# EAGLE design j310 lna (EAGLE 9.1.2)
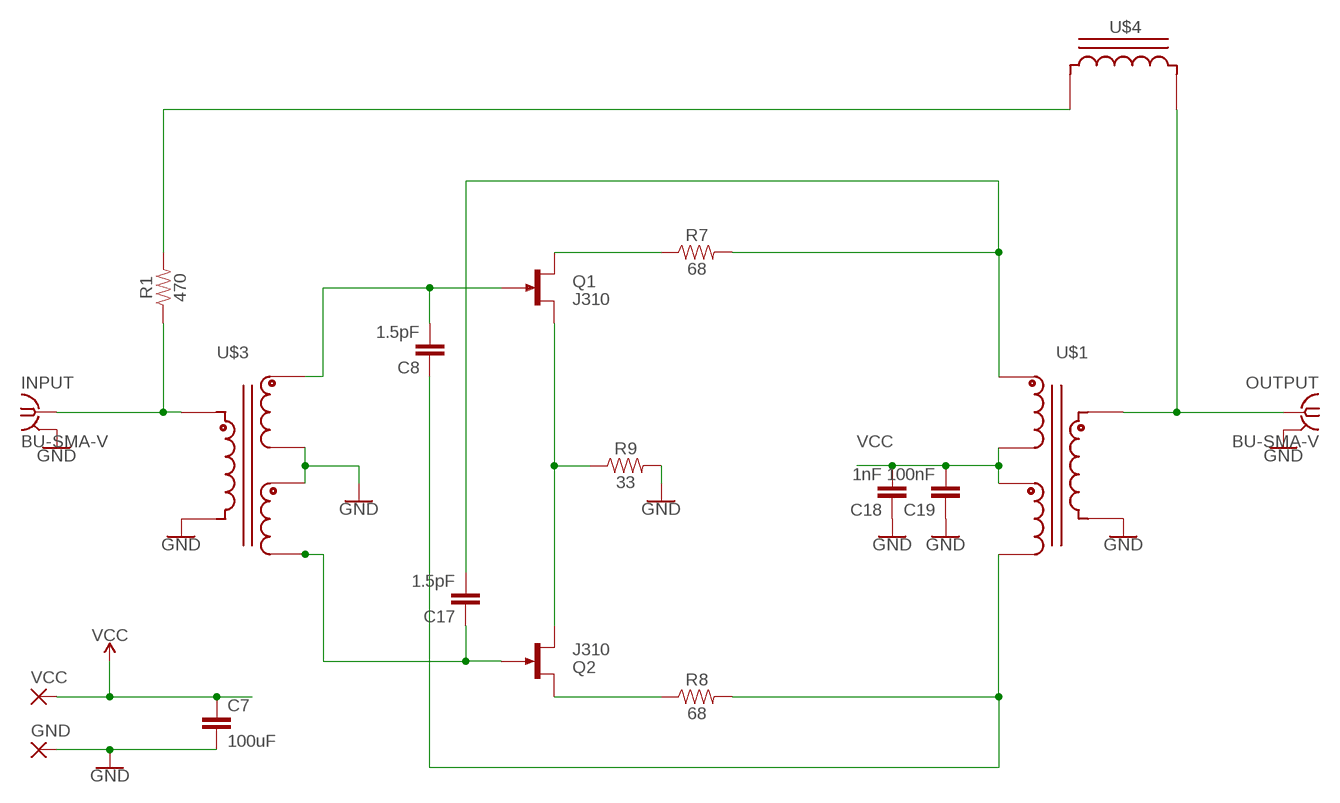
[diagram p0: schematic, sheet 1]

## Parts
C7  100uF  C5/3.5  [C5B3.5]
C8  1.5pF  C5/3.5  [C5B3.5]
C17  1.5pF  C5/3.5  [C5B3.5]
C18  1nF  C5/3.5  [C5B3.5]
C19  100nF  C5/3.5  [C5B3.5]
GND  3,17/1,1  [3,17/1,1]
INPUT  BU-SMA-V  [BU-SMA-V]
OUTPUT  BU-SMA-V  [BU-SMA-V]
Q1  J310  [TO92R]
Q2  J310  [TO92R]
R1  470  1KOHM-HORIZ-1/4W-1%  [AXIAL-0.3]
R7  68  1KOHM-HORIZ-1/4W-1%  [AXIAL-0.3]
R8  68  1KOHM-HORIZ-1/4W-1%  [AXIAL-0.3]
R9  33  1KOHM-HORIZ-1/4W-1%  [AXIAL-0.3]
U$1  T50_SPLITTER  [T50_SPLITTER]
U$3  T50_SPLITTER  [T50_SPLITTER]
U$4  T37_INDUCTOR  [T37_INDUCTOR]
VCC  3,17/1,1  [3,17/1,1]

## Nets
GND: C7.2 C18.1 C19.1 GND.1(P) INPUT.2 INPUT.3 INPUT.4 INPUT.5 OUTPUT.2 OUTPUT.3 OUTPUT.4 OUTPUT.5 R9.P$2 U$1.C1A U$3.C1A U$3.C2A(C3B) U$3.C3A(C2A)
N$1: OUTPUT.1 U$1.C1B U$4.CA
N$2: R1.P$2 U$4.CB
N$3: Q2.D R8.P$1
N$19: C8.2 Q1.G U$3.C3B(C2B)
N$20: Q1.D R7.P$1
N$21: C17.1 Q2.G U$3.C2B(C3A)
N$22: INPUT.1 R1.P$1 U$3.C1B
N$24: Q1.S Q2.S R9.P$1
N$25: C17.2 R7.P$2 U$1.C3B(C2B)
N$26: C8.1 R8.P$2 U$1.C2B(C3A)
VCC: C7.1 C18.2 C19.2 U$1.C2A(C3B) U$1.C3A(C2A) VCC.1(P)

## Library data of the parts
C7 C8 C17-C19 = capacitor-wima:C: CAPACITOR naming: grid - package width
GND VCC = wirepad:3,17/1,1: THROUGH-HOLE PAD
INPUT OUTPUT = con-coax:BU-SMA-V: FEMALE SMA CONNECTOR Radiall distributor RS 112-3794; OC_FARNELL: unknown; OC_NEWARK: unknown
Q1 Q2 = transistor-small-signal:J310: N-Channel RF Amplifier J309, J310 Source: http://www.fairchildsemi.com/pf/J3/J310.html
R1 R7-R9 = SparkFun-Resistors:1KOHM: 1kΩ resistor A resistor is a passive two-terminal electrical component that implements electrical resistance as a circuit element. Resistors act to reduce current flow, and, at the same time, act to lower voltage levels within circuits. - Wikipedia; PROD_ID: RES-12182; VALUE: 1k
U$1 U$3 = toroid:T50_SPLITTER: Transformer (having 3 windings) on a T50 Toroid
U$4 = toroid:T37_INDUCTOR: Inductor wound on a T37 Toroid

## Net classes
0 default: width 0.762 mm, drill 0.762 mm, clearance 0.508 mm

## Board
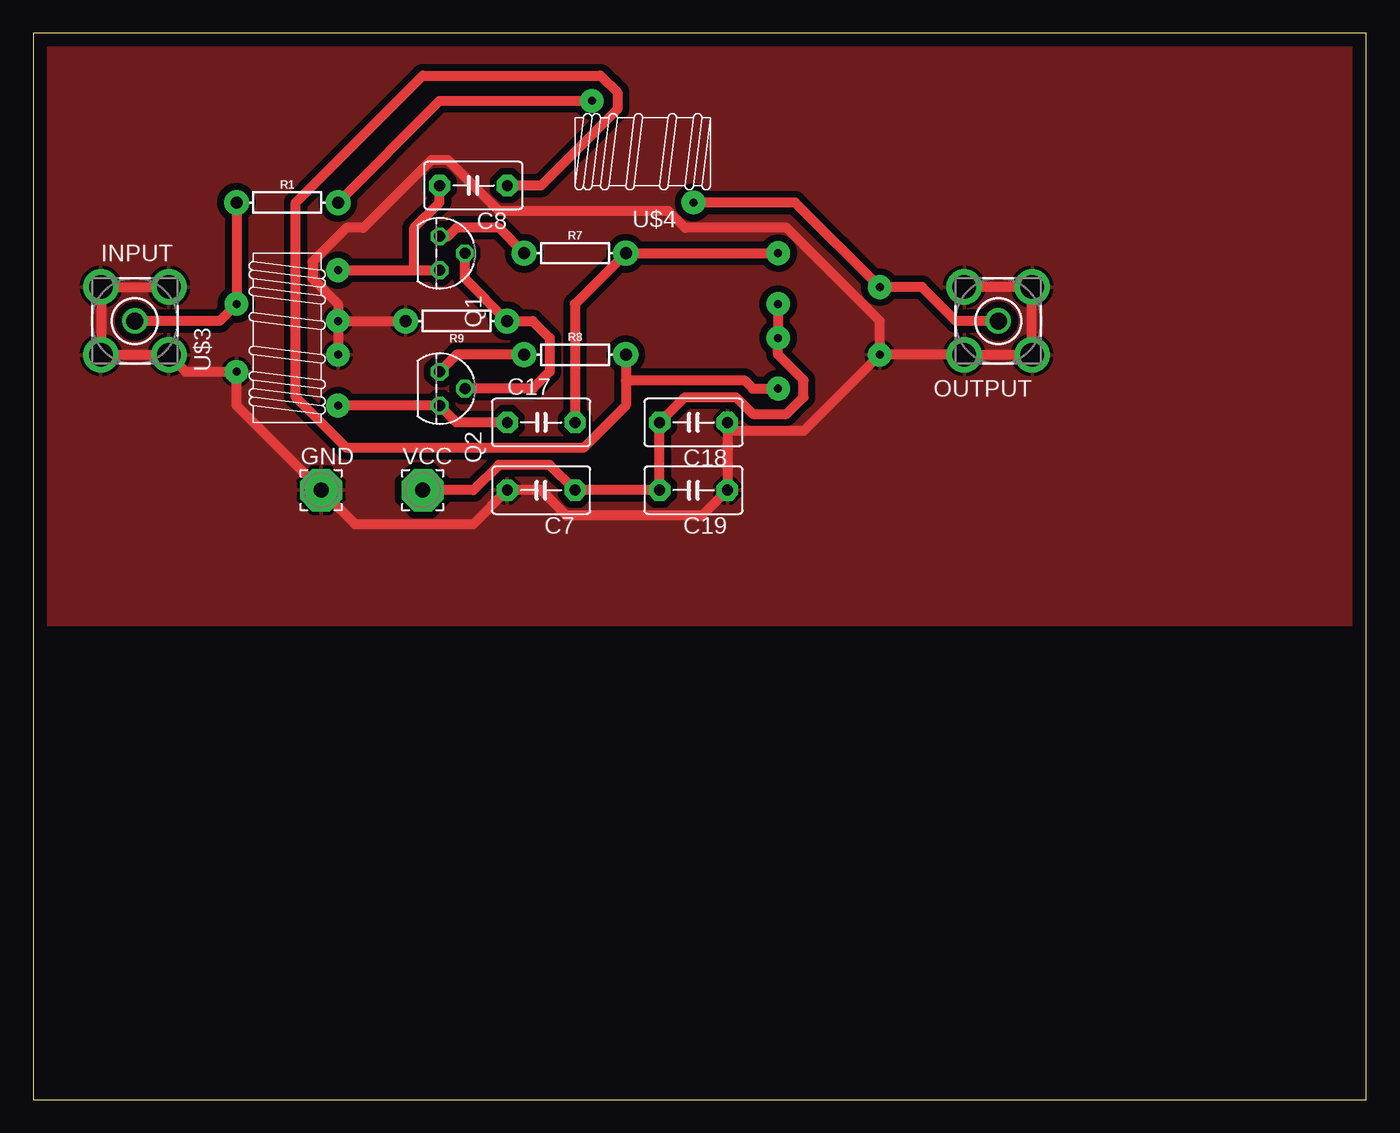
[diagram p1: board, top side]
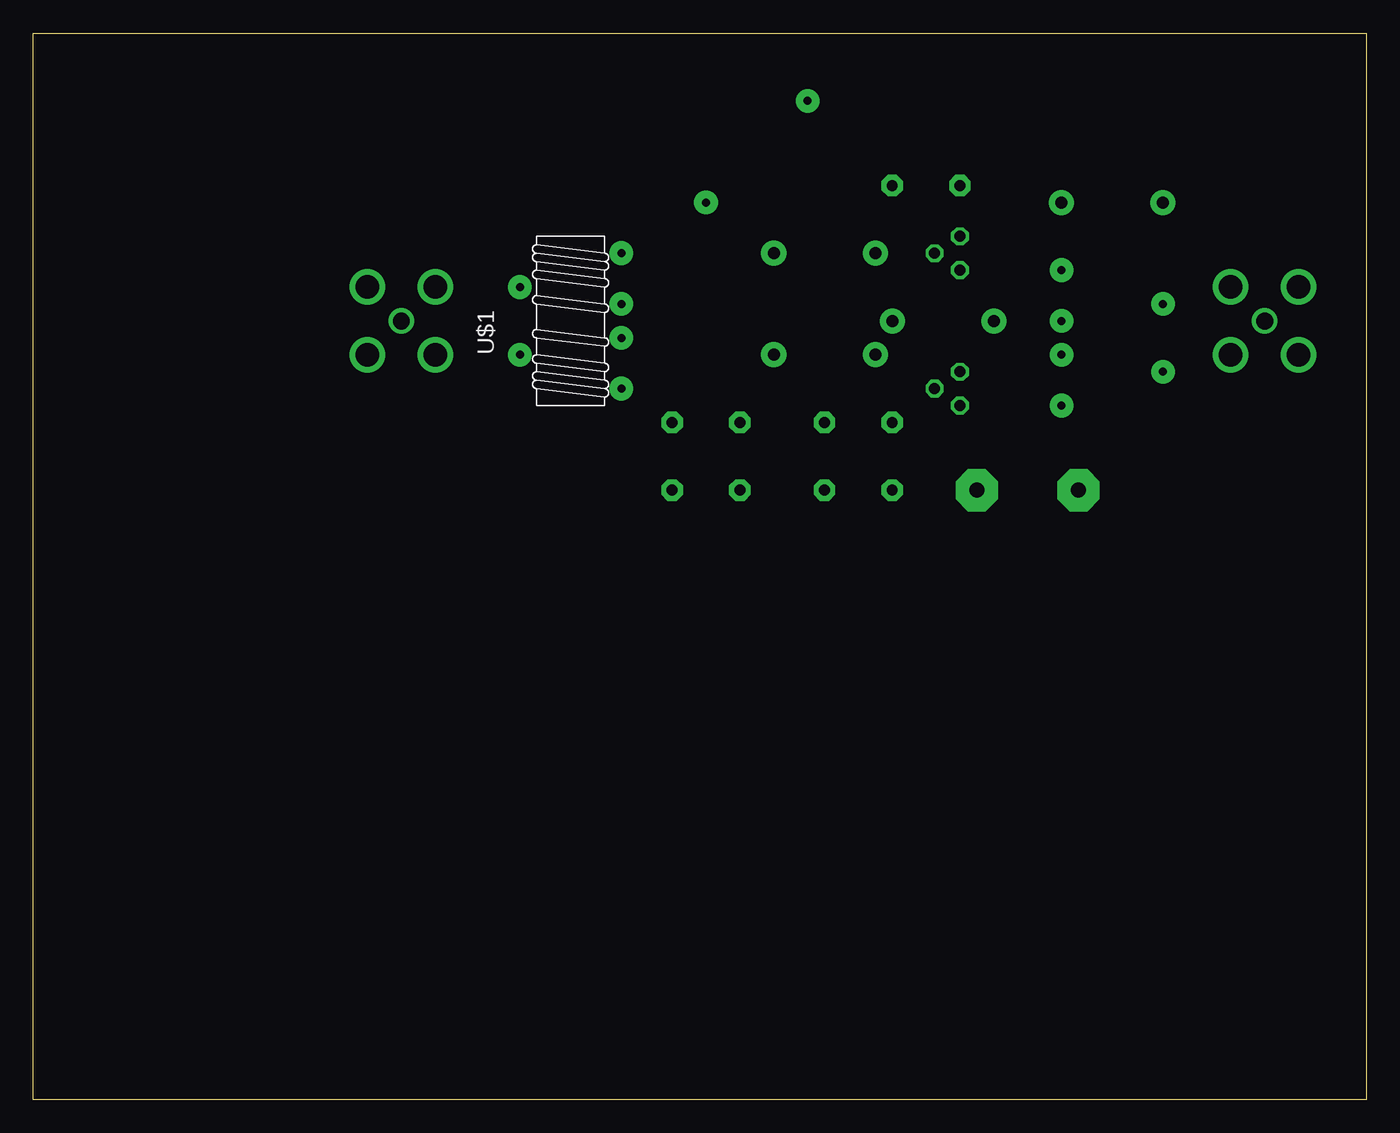
[diagram p2: board, bottom side, seen from below]

Size 100 x 80 mm. Coordinates in mm from the lower left corner, seen from the top.
Outline: 0,0 100,0 100,80 0,80 0,0
Copper layers (1*16): Top 0.035mm / dielectric 1.5mm / Bottom 0.035mm
Design rules "default": minimum track width 6mil, minimum drill 0.35mm, track to track 6mil, track to pad 6mil, pad to pad 6mil, via to via 6mil, smd to smd 6mil, copper to edge 40mil, drill to drill 6mil, minimum pad ring 10mil, minimum via ring 8mil, stop-mask expansion 4mil, vias tented up to drill 0mil, thermal gap 10mil

### Footprints (pad centres in the part's own frame; a part is rotated, then mirrored left to right if it is on the bottom)
C5B3.5 = drill 0.813 pad 1.6 octagon: 1 -2.54,0; 2 2.54,0
3,17/1,1 = drill 1.118 pad 3.175 octagon: 1 0,0
BU-SMA-V = drill 1.27: 1 0,0 | drill 1.778: 2 -2.55,2.55; 3 2.55,2.55; 4 2.55,-2.55; 5 -2.55,-2.55
TO92R = drill 0.813 octagon: D -1.27,0; G 1.27,0; S 0,1.905
AXIAL-0.3 = drill 0.9 pad 1.88: P$1 -3.81,0; P$2 3.81,0
T50_SPLITTER = drill 0.6 pad 1.778: C1A -1.27,-5.08; C1B -1.27,0; C2A 6.35,-3.81; C2B 6.35,-7.62; C3A 6.35,-1.27; C3B 6.35,2.54
T37_INDUCTOR = drill 0.6 pad 1.778: CA -3.81,-3.81; CB 3.81,3.81

### Placement (x,y rotation side)
C7  38.1,45.72 180 top
C8  33.02,68.58 180 top
C17  38.1,50.8 0 top
C18  49.53,50.8 180 top
C19  49.53,45.72 180 top
GND  21.59,45.72 0 top
INPUT  7.62,58.42 0 top
OUTPUT  72.39,58.42 180 top
Q1  30.48,63.5 270 top
Q2  30.48,53.34 270 top
R1  19.05,67.31 0 top
R7  40.64,63.5 0 top
R8  40.64,55.88 0 top
R9  31.75,58.42 180 top
U$1  62.23,60.96 0 bottom
U$3  16.51,59.69 0 top
U$4  45.72,71.12 90 top
VCC  29.21,45.72 0 top

### Tracks (layer width: path | path; a pad name or v marks a point on that pad's centre or on a via)
GND
  Top 0.762: INPUT.2 INPUT.5 | INPUT.5 | INPUT.2 | INPUT.2 INPUT.3 | INPUT.5 INPUT.4 10.79,55.24 11.43,54.61 U$3.C1A 15.24,52.07 GND.1 24.13,43.18 33.02,43.18 C7.2 38.1,45.72 40.01,43.81 50.16,43.81 C19.1 52.07,50.16 | OUTPUT.5 OUTPUT.4 | OUTPUT.5 | U$3.C3A U$3.C2A | U$3.C3A R9.P$2 | 52.07,50.16 C18.1 52.07,50.16 | U$1.C1A 69.22,55.88 OUTPUT.3 OUTPUT.2 | 52.07,50.16 57.78,50.16 U$1.C1A | OUTPUT.2 | U$3.C3A 22.86,59.69 20.95,61.59 20.95,62.87 23.5,65.41 24.77,65.41 29.84,70.48 31.11,70.48 34.92,66.67 47.62,66.67 48.9,65.41 56.52,65.41 63.5,58.42 U$1.C1A | OUTPUT.2 OUTPUT.5
  pour Top: 0,80.01 100.33,80.01 100.33,35.56 0,35.56
N$1
  Top 0.762: OUTPUT.1 69.22,58.42 66.67,60.96 U$1.C1B 57.15,67.31 U$4.CA
N$2
  Top 0.762: U$4.CB 30.48,74.93 R1.P$2
N$3
  Top 0.762: Q2.D 31.75,55.88 R8.P$1
N$19
  Top 0.762: U$3.C3B 28.57,62.23 | 28.57,62.23 Q1.G | C8.2 30.48,67.31 28.57,65.41 28.57,62.23
N$20
  Top 0.762: Q1.D 31.11,64.77 31.75,65.41 34.92,65.41 R7.P$1
N$21
  Top 0.762: C17.1 31.75,50.8 Q2.G U$3.C2B
N$22
  Top 0.762: R1.P$1 U$3.C1B 13.97,58.42 INPUT.1
N$24
  Top 0.762: Q2.S 37.47,53.34 38.73,54.61 38.73,57.15 37.47,58.42 R9.P$1 32.38,61.59 Q1.S
N$25
  Top 0.762: C17.2 40.64,59.69 R7.P$2 U$1.C3B
N$26
  Top 0.762: C8.1 38.1,68.58 43.81,74.3 43.81,75.56 42.55,76.83 29.21,76.83 19.68,67.31 19.68,52.7 23.5,48.9 41.27,48.9 44.45,52.07 44.45,53.98 | R8.P$2 44.45,53.98 | U$1.C2B 53.98,53.34 53.34,53.98 44.45,53.98
VCC
  Top 0.762: U$1.C3A U$1.C2A 55.88,55.88 57.78,53.98 57.78,52.7 56.52,51.44 53.98,51.44 52.7,52.7 48.9,52.7 C18.2 C19.2 C7.1 38.73,47.62 34.92,47.62 33.02,45.72 VCC.1